# Altium project QUTMS-PDMC-V00.PrjPcb
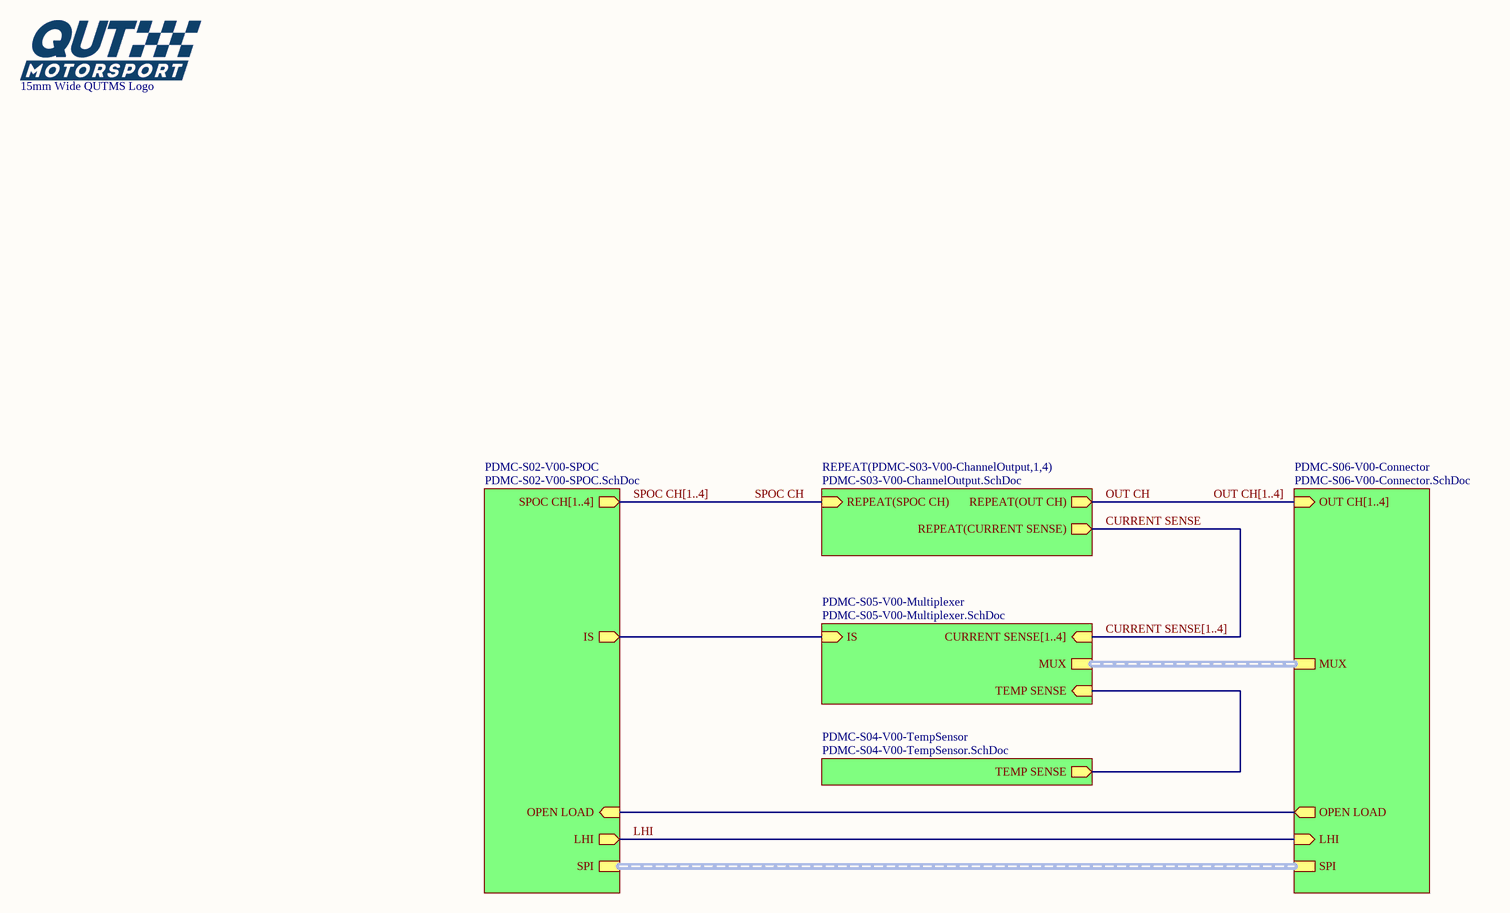
[diagram p0: PDMC-S01-V00-PowerDistributionModuleCard.SchDoc]
6 sheets, 77 parts. Net scope: hierarchical (ports join the sheet entries above them; power ports are global).
Board file: PDMC-P00-V00.PcbDoc
Sheets:
  PDMC-S01-V00-PowerDistributionModuleCard.SchDoc
    PDMC-S02-V00-SPOC = PDMC-S02-V00-SPOC.SchDoc
    PDMC-S06-V00-Connector = PDMC-S06-V00-Connector.SchDoc
    PDMC-S03-V00-ChannelOutput1 = PDMC-S03-V00-ChannelOutput.SchDoc
    PDMC-S03-V00-ChannelOutput2 = PDMC-S03-V00-ChannelOutput.SchDoc
    PDMC-S03-V00-ChannelOutput3 = PDMC-S03-V00-ChannelOutput.SchDoc
    PDMC-S03-V00-ChannelOutput4 = PDMC-S03-V00-ChannelOutput.SchDoc
    PDMC-S05-V00-Multiplexer = PDMC-S05-V00-Multiplexer.SchDoc
    PDMC-S04-V00-TempSensor = PDMC-S04-V00-TempSensor.SchDoc

## Sheet PDMC-S01-V00-PowerDistributionModuleCard.SchDoc: PDMC Master
size A3; DrawnBy: Zoe Goodward; Organization: QUT Motorsport; Address1: O-120, Gardens Point; Address2: 2 George Street; Address3: Brisbane, QLD 4000; Address4: Australia; DocumentNumber: 1; Revision: 01; SheetNumber: 1; SheetTotal: 6; Version: 01; Project: Power Distribution Module Card; PageSetup: Record=PageOptions|CenterHorizontal=True|CenterVertical=True|PrintScale=0.97|XCorrection=1.00|YCorrection=1.00|PrintKind=0|BorderSize=5000000|LeftOffset=0|BottomOffset=0|Orientation=2|PaperLength=1000|PaperWidth=1000|Scale=100|PaperSource=7|PrintQuality=-4|MediaType=1|DitherType=10|PaperKind=A4|PrintScaleMode=1

### Parts
LOGO1  15mm Wide QUTMS Logo  [QUTMS LOGO 15MM]

### Sub-sheets
PDMC-S02-V00-SPOC = PDMC-S02-V00-SPOC.SchDoc: SPOC CH[1..4] (out), IS (out), SPI (harness SPI), LHI (out), OPEN LOAD (in)
PDMC-S04-V00-TempSensor = PDMC-S04-V00-TempSensor.SchDoc: TEMP SENSE (out)
PDMC-S05-V00-Multiplexer = PDMC-S05-V00-Multiplexer.SchDoc: CURRENT SENSE[1..4] (in), IS (in), MUX (harness MUX), TEMP SENSE (in)
PDMC-S06-V00-Connector = PDMC-S06-V00-Connector.SchDoc: OUT CH[1..4] (in), MUX (harness MUX), SPI (harness SPI), LHI (in), OPEN LOAD (out)
REPEAT(PDMC-S03-V00-ChannelOutput,1,4) = PDMC-S03-V00-ChannelOutput.SchDoc: REPEAT(SPOC CH) (in), REPEAT(OUT CH) (out), REPEAT(CURRENT SENSE) (out)

### Nets
CURRENT SENSE: sheet REPEAT(PDMC-S03-V00-ChannelOutput,1,4)/REPEAT(CURRENT SENSE)
LHI: sheet PDMC-S02-V00-SPOC/LHI, sheet PDMC-S06-V00-Connector/LHI
OPEN LOAD: sheet PDMC-S02-V00-SPOC/OPEN LOAD, sheet PDMC-S06-V00-Connector/OPEN LOAD
OUT CH: sheet REPEAT(PDMC-S03-V00-ChannelOutput,1,4)/REPEAT(OUT CH)
SPOC CH: sheet REPEAT(PDMC-S03-V00-ChannelOutput,1,4)/REPEAT(SPOC CH)
SPOC SENSE: sheet PDMC-S02-V00-SPOC/IS, sheet PDMC-S05-V00-Multiplexer/IS
TEMP SENSE: sheet PDMC-S05-V00-Multiplexer/TEMP SENSE, sheet PDMC-S04-V00-TempSensor/TEMP SENSE

### Buses and harness runs
bus CURRENT SENSE[1..4] = sheet PDMC-S05-V00-Multiplexer/CURRENT SENSE[1..4]
bus OUT CH[1..4] = sheet PDMC-S06-V00-Connector/OUT CH[1..4]
bus SPOC CH[1..4] = sheet PDMC-S02-V00-SPOC/SPOC CH[1..4]
harness sheet PDMC-S02-V00-SPOC/SPI = sheet PDMC-S06-V00-Connector/SPI
harness sheet PDMC-S05-V00-Multiplexer/MUX = sheet PDMC-S06-V00-Connector/MUX

### Notes on the sheet
- Revision History:
- Sheet Title:
- Rev
- Date
- Description
- Project:
- Size:
- Drawn By:
- A3
- Number:
- Revision:
- Sheet
- Version:
- of
- QUT Motorsport
- O-120, Gardens Point
- 2 George Street
- Brisbane, QLD 4000
- Australia
- Print Date:
- Print Time:
- File Name:

### Library data of the parts
LOGO1 = QUTMS Logo 15mm

## Sheet PDMC-S02-V00-SPOC.SchDoc: SPOC
size A3; DrawnBy: Zoe Goodward; Organization: QUT Motorsport; Address1: O-120, Gardens Point; Address2: 2 George Street; Address3: Brisbane, QLD 4000; Address4: Australia; DocumentNumber: 2; Revision: 01; SheetNumber: 2; SheetTotal: 6; Version: 01; Project: Power Distribution Module Card; PageSetup: Record=PageOptions|CenterHorizontal=True|CenterVertical=True|PrintScale=0.97|XCorrection=1.00|YCorrection=1.00|PrintKind=0|BorderSize=5000000|LeftOffset=0|BottomOffset=0|Orientation=2|PaperLength=1000|PaperWidth=1000|Scale=100|PaperSource=7|PrintQuality=-4|MediaType=1|DitherType=10|PaperKind=A4|PrintScaleMode=1
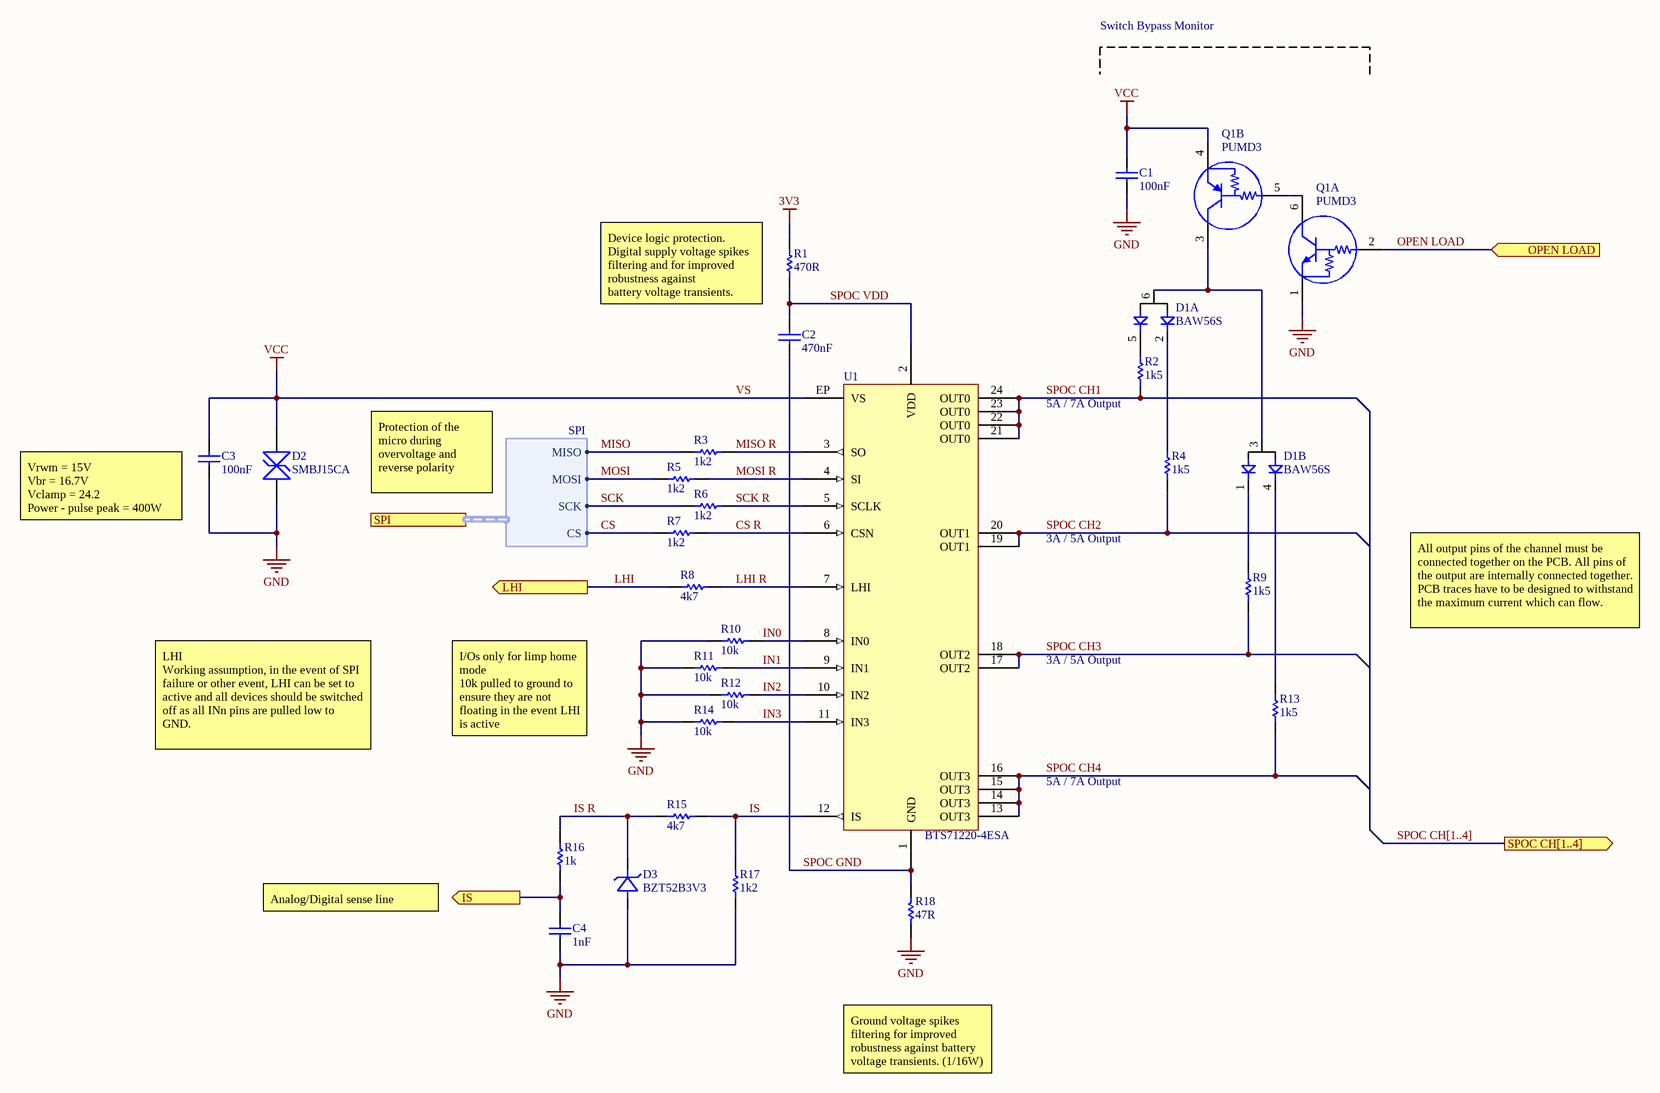
[diagram p1: PDMC-S02-V00-SPOC.SchDoc]

### Parts
C1  100nF  [Cap_Ceramic_0603]
C2  470nF  [Cap_Ceramic_0603]
C3  100nF  [Cap_Ceramic_0603]
C4  1nF  [Cap_Ceramic_0603]
D1  BAW56S  [TSSOP6]  (parts A,B of 2)
D2  SMBJ15CA  [DO-214AA]
D3  BZT52B3V3  [SOD123]
Q1  PUMD3  [TSSOP6]  (parts A,B of 2)
R1  470R  [Res_ThinFilm_1210]
R2  1k5  [Res_ThinFilm_0603]
R3  1k2  [Res_ThinFilm_0603]
R4  1k5  [Res_ThinFilm_0603]
R5  1k2  [Res_ThinFilm_0603]
R6  1k2  [Res_ThinFilm_0603]
R7  1k2  [Res_ThinFilm_0603]
R8  4k7  [Res_ThinFilm_0603]
R9  1k5  [Res_ThinFilm_0603]
R10  10k  [Res_ThinFilm_0603]
R11  10k  [Res_ThinFilm_0603]
R12  10k  [Res_ThinFilm_0603]
R13  1k5  [Res_ThinFilm_0603]
R14  10k  [Res_ThinFilm_0603]
R15  4k7  [Res_ThinFilm_0603]
R16  1k  [Res_ThinFilm_0603]
R17  1k2  [Res_ThinFilm_0603]
R18  47R  [Res_ThinFilm_0603]
U1  BTS71220-4ESA  [PG-TSDO-24-32]

### Ports
IS (out), LHI (out), OPEN LOAD (in), SPI (harness SPI), SPOC CH[1..4] (out)

### Harnesses
SPI: MOSI, MISO, SCK, CS

### Nets
3V3: R1.2
GND: C1.1 C3.1 C4.1 D2.1 D3.A(Anode) Q1.1(E1) R10.1 R11.1 R12.1 R14.1 R17.1 R18.1
VS: C1.2 C3.2 D2.2 Q1.4(E2) U1.EP(VS)  [also labelled VCC]
CS: R7.1 ; port SPI.CS
CS R: R7.2 U1.6(CSN)
IN0: R10.2 U1.8(IN0)
IN1: R11.2 U1.9(IN1)
IN2: R12.2 U1.10(IN2)
IN3: R14.2 U1.11(IN3)
IS: R15.2 R17.2 U1.12(IS)
IS R: D3.K(Cathode) R15.1 R16.2
LHI: R8.1 ; port LHI
LHI R: R8.2 U1.7(LHI)
MISO: R3.1 ; port SPI.MISO
MISO R: R3.2 U1.3(SO)
MOSI: R5.1 ; port SPI.MOSI
MOSI R: R5.2 U1.4(SI)
OPEN LOAD: Q1.2(B1) ; port OPEN LOAD
SCK: R6.1 ; port SPI.SCK
SCK R: R6.2 U1.5(SCLK)
SPOC CH1: R2.1 U1.21(OUT0) U1.22(OUT0) U1.23(OUT0) U1.24(OUT0)
SPOC CH2: R4.1 U1.19(OUT1) U1.20(OUT1)
SPOC CH3: R9.1 U1.17(OUT2) U1.18(OUT2)
SPOC CH4: R13.1 U1.13(OUT3) U1.14(OUT3) U1.15(OUT3) U1.16(OUT3)
SPOC GND: C2.1 R18.2 U1.1(GND)
SPOC SENSE: C4.2 R16.1 ; port IS
SPOC VDD: C2.2 R1.1 U1.2(VDD)
NetD1_1: D1.1 R9.2
NetD1_2: D1.2 R4.2
NetD1_3: D1.3 D1.6 Q1.3(C2)
NetD1_4: D1.4 R13.2
NetD1_5: D1.5 R2.2
NetQ1_5: Q1.5(B2) Q1.6(C1)

### Buses and harness runs
bus SPOC CH[1..4] = port SPOC CH[1..4]

### Notes on the sheet
- Switch Bypass Monitor
- Device logic protection.
  Digital supply voltage spikes filtering and for improved robustness against
  battery voltage transients.
- (near R2) 5A / 7A Output
- (near C3) Vrwm = 15V
  Vbr = 16.7V
  Vclamp = 24.2
  Power - pulse peak = 400W
- Protection of the micro during overvoltage and reverse polarity
- 3A / 5A Output
- All output pins of the channel must be connected together on the PCB. All pins of the output are internally connected together.
  PCB traces have to be designed to withstand the maximum current which can flow.
- I/Os only for limp home mode
  10k pulled to ground to ensure they are not floating in the event LHI is active
- LHI
  Working assumption, in the event of SPI failure or other event, LHI can be set to active and all devices should be switched off as all INn pins are pulled low to GND.
- 5A / 7A Output
- Analog/Digital sense line
- Ground voltage spikes filtering for improved robustness against battery voltage transients. (1/16W)
- Revision History:
- Sheet Title:
- Rev
- Date
- Description
- Project:
- Size:
- Drawn By:
- A3
- Number:
- Revision:
- Sheet
- Version:
- of
- QUT Motorsport
- O-120, Gardens Point
- 2 George Street
- Brisbane, QLD 4000
- Australia
- Print Date:
- Print Time:
- File Name:

### Library data of the parts
C1 C3 = 100nF 50V 5% X7R 0603: Capacitor, Ceramic, SMD, 100nF, 50V, 5%, X7R, 0603
C2 = 470nF 50V 5% X7R 0603: Capacitor, Ceramic, SMD, 470nF, 50V, 5%, X7R, 0603
C4 = 1nF 50V 5% X7R 0603: Capacitor, Ceramic, SMD, 1nF, 25V, 5%, X7R, 0603
D1 = BAW56S: Diode Array 2 Pair Common Anode Standard 90V 250mA (DC) Surface Mount 6-TSSOP, SC-88, SOT-363; ComponentLink1Description: Digikey; ComponentLink1URL: https://www.digikey.com.au/product-detail/en/nexperia-usa-inc/BAW56S-115/1727-4833-1-ND/2531320; ComponentLink2Description: Datasheet; ComponentLink2URL: https://assets.nexperia.com/documents/data-sheet/BAV756S_BAW56_SER.pdf
D2 = SMBJ15CA: Diode, SMD, TVS, 15V, 24.4V, 24.6A Ipp, DO-214AA; ComponentLink1Description: Datasheet; ComponentLink1URL: https://www.littelfuse.com/~/media/electronics/datasheets/tvs_diodes/littelfuse_tvs_diode_smbj_datasheet.pdf.pdf; ComponentLink2Description: Digikey; ComponentLink2URL: https://www.digikey.com.au/product-detail/en/littelfuse-inc/SMBJ15CA/SMBJ15CALFCT-ND/285983
D3 = BZT52B3V3: Diode, SMD, Zener, 3.3V, 2%, 410mW, SOD-123; ComponentLink1Description: Datasheet; ComponentLink1URL: https://www.vishay.com/docs/85760/bzt52.pdf; ComponentLink2Description: Digikey; ComponentLink2URL: https://www.digikey.com/product-detail/en/vishay-semiconductor-diodes-division/BZT52B3V3-E3-08/112-BZT52B3V3-E3-08CT-ND/8564806
Q1 = PUMD3: Pre-Biased Bipolar Transistor (BJT) 1 NPN, 1 PNP - Pre-Biased (Dual) 50V 100mA 300mW Surface Mount 6-TSSOP; ComponentLink1Description: Datasheet; ComponentLink1URL: https://assets.nexperia.com/documents/data-sheet/PEMD3_PIMD3_PUMD3.pdf; ComponentLink2Description: Digikey; ComponentLink2URL: https://www.digikey.com.au/product-detail/en/nexperia-usa-inc/PUMD3-165/1727-1984-1-ND/5221957
R1 = 470R 5% 1210: Resistor, SMD, 470R, 0.25W, 5%, 1210
R2 R4 R9 R13 = 1k5 5% 0603: Resistor, SMD, 1k5, 0.1W, 5%, 0603
R3 R5-R7 R17 = 1k2 5% 0603: Resistor, SMD, 1k2, 0.1W, 5%, 0603
R8 R15 = 4k7 5% 0603: Resistor, SMD, 4k7, 0.1W, 5%, 0603
R10-R12 R14 = 10k 5% 0603: Resistor, SMD, 10k, 0.1W, 5%, 0603
R16 = 1k 5% 0603: Resistor, SMD, 1k, 0.1W, 5%, 0603
R18 = 47R 5% 0603: Resistor, SMD, 47R, 0.1W, 5%, 0603
U1 = BTS71220-4ESA: The BTS71220-4ESA is a SPI Power Controller, providing protection functions and diagnosis. The device is integrated in SMART7 technology.; ComponentLink1Description: Datasheet; ComponentLink1URL: https://www.infineon.com/dgdl/Infineon-BTS71220-4ESA-DS-v01_00-EN.pdf?fileId=5546d462636cc8fb0163feaaf85408d1; ComponentLink2Description: Digikey; ComponentLink2URL: https://www.digikey.com.au/product-detail/en/infineon-technologies/BTS712204ESAXUMA1/BTS712204ESAXUMA1CT-ND/9678741

## Sheet PDMC-S06-V00-Connector.SchDoc: Connectors
size A3; DrawnBy: Zoe Goodward; Organization: QUT Motorsport; Address1: O-120, Gardens Point; Address2: 2 George Street; Address3: Brisbane, QLD 4000; Address4: Australia; DocumentNumber: 6; Revision: 01; SheetNumber: 6; SheetTotal: 6; Version: 01; Project: Power Distribution Module Card; PageSetup: Record=PageOptions|CenterHorizontal=True|CenterVertical=True|PrintScale=0.97|XCorrection=1.00|YCorrection=1.00|PrintKind=0|BorderSize=5000000|LeftOffset=0|BottomOffset=0|Orientation=2|PaperLength=1000|PaperWidth=1000|Scale=100|PaperSource=7|PrintQuality=-4|MediaType=1|DitherType=10|PaperKind=A4|PrintScaleMode=1
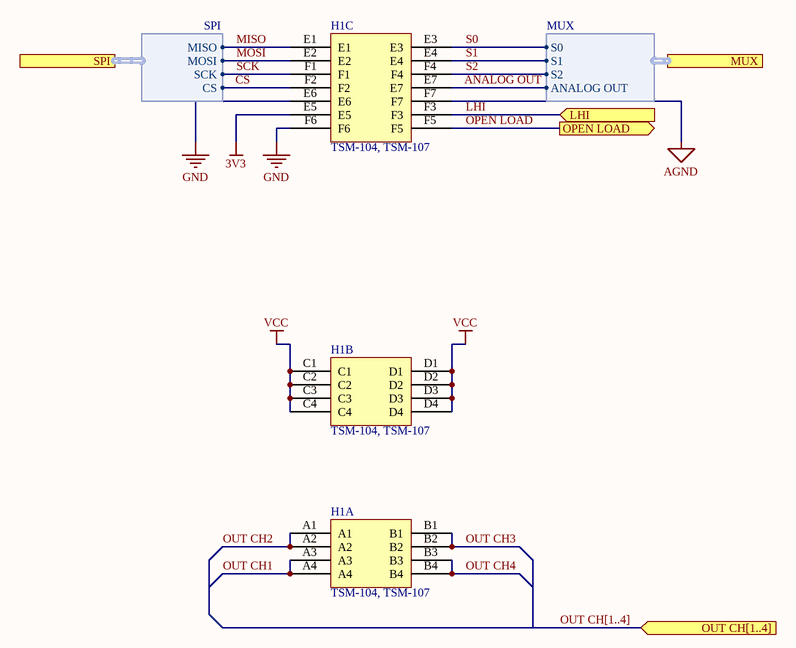
[diagram p2: PDMC-S06-V00-Connector.SchDoc]

### Parts
H1  TSM-104, TSM-107  [TSM-104, TSM-107]  (parts A,B,C of 3)

### Ports
LHI (in), MUX (harness MUX), OPEN LOAD (out), OUT CH[1..4] (in), SPI (harness SPI)

### Harnesses
MUX: ANALOG OUT, S0, S1, S2
SPI: MOSI, MISO, SCK, CS

### Nets
3V3: H1.E5
AGND: H1.F7
GND: H1.E6 H1.F6
VCC: H1.C1 H1.C2 H1.C3 H1.C4 H1.D1 H1.D2 H1.D3 H1.D4  [project net VS]
ANALOG OUT: H1.E7 ; port MUX.ANALOG OUT
CS: H1.F2 ; port SPI.CS
LHI: H1.F3 ; port LHI
MISO: H1.E1 ; port SPI.MISO
MOSI: H1.E2 ; port SPI.MOSI
OPEN LOAD: H1.F5 ; port OPEN LOAD
OUT CH1: H1.A3 H1.A4
OUT CH2: H1.A1 H1.A2
OUT CH3: H1.B1 H1.B2
OUT CH4: H1.B3 H1.B4
S0: H1.E3 ; port MUX.S0
S1: H1.E4 ; port MUX.S1
S2: H1.F4 ; port MUX.S2
SCK: H1.F1 ; port SPI.SCK

### Buses and harness runs
bus OUT CH[1..4] = port OUT CH[1..4]

### Notes on the sheet
- Revision History:
- Sheet Title:
- Rev
- Date
- Description
- Project:
- Size:
- Drawn By:
- A3
- Number:
- Revision:
- Sheet
- Version:
- of
- QUT Motorsport
- O-120, Gardens Point
- 2 George Street
- Brisbane, QLD 4000
- Australia
- Print Date:
- Print Time:
- File Name:

### Library data of the parts
H1 = TSM-104, TSM-107: CONN HEADER SMD R/A 8POS and 14POS 2.54MM; ComponentLink1Description: Digikey; ComponentLink1URL: https://www.digikey.com.au/product-detail/en/samtec-inc/TSM-104-01-L-DH/SAM10277-ND/6679014; ComponentLink2Description: Digikey; ComponentLink2URL: https://www.digikey.com.au/product-detail/en/samtec-inc/TSM-107-01-L-DH/SAM15902-ND/7638593; ComponentLink3Description: Datasheet; ComponentLink3URL: http://suddendocs.samtec.com/catalog_english/tsm.pdf

## Sheet PDMC-S03-V00-ChannelOutput.SchDoc: Channel Output and Current Sensing
size A3; DrawnBy: Zoe Goodward; Organization: QUT Motorsport; Address1: O-120, Gardens Point; Address2: 2 George Street; Address3: Brisbane, QLD 4000; Address4: Australia; DocumentNumber: 3; Revision: 01; SheetNumber: 3; SheetTotal: 6; Version: 01; Project: Power Distribution Module Card; PageSetup: Record=PageOptions|CenterHorizontal=True|CenterVertical=True|PrintScale=0.97|XCorrection=1.00|YCorrection=1.00|PrintKind=0|BorderSize=5000000|LeftOffset=0|BottomOffset=0|Orientation=2|PaperLength=1000|PaperWidth=1000|Scale=100|PaperSource=7|PrintQuality=-4|MediaType=1|DitherType=10|PaperKind=A4|PrintScaleMode=1
Used 4 times, as channels PDMC-S03-V00-ChannelOutput1, PDMC-S03-V00-ChannelOutput2, PDMC-S03-V00-ChannelOutput3, PDMC-S03-V00-ChannelOutput4. Parts and nets are listed once, with the designators drawn on the sheet.
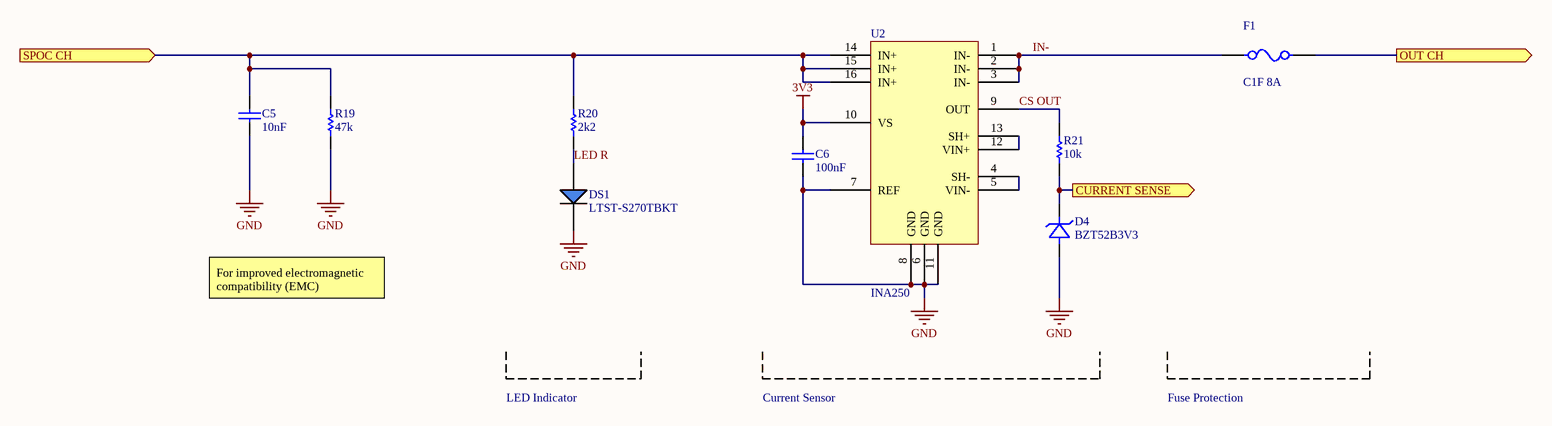
[diagram p3: PDMC-S03-V00-ChannelOutput.SchDoc]

### Parts
C5  10nF  [Cap_Ceramic_0603]
C6  100nF  [Cap_Ceramic_0603]
D4  BZT52B3V3  [SOD123]
DS1  LTST-S270TBKT  [LTST-S270TBKT]
F1  C1F 8A  [FUSE_1206]
R19  47k  [Res_ThinFilm_0603]
R20  2k2  [Res_ThinFilm_0603]
R21  10k  [Res_ThinFilm_0603]
U2  INA250  [TSSOP-16N]

### Ports
CURRENT SENSE (out), OUT CH (out), SPOC CH (in)

### Nets
3V3: C6.2 U2.10(VS)
GND: C5.1 C6.1 D4.A(Anode) DS1.K R19.1 U2.6(GND) U2.7(REF) U2.8(GND) U2.11(GND)
CS OUT: R21.2 U2.9(OUT)
CURRENT SENSE: D4.K(Cathode) R21.1 ; port CURRENT SENSE
IN-: F1.1 U2.1(IN-) U2.2(IN-) U2.3(IN-)
LED R: DS1.A R20.1
OUT CH: F1.2 ; port OUT CH
SPOC CH: C5.2 R19.2 R20.2 U2.14(IN+) U2.15(IN+) U2.16(IN+) ; port SPOC CH
NetU2_4: U2.4(SH-) U2.5(VIN-)
NetU2_12: U2.12(VIN+) U2.13(SH+)

### Channels
PDMC-S03-V00-ChannelOutput1: designators end in A; ports CURRENT SENSE=CURRENT SENSE1 OUT CH=OUT CH1 SPOC CH=SPOC CH1
PDMC-S03-V00-ChannelOutput2: designators end in B; ports CURRENT SENSE=CURRENT SENSE2 OUT CH=OUT CH2 SPOC CH=SPOC CH2
PDMC-S03-V00-ChannelOutput3: designators end in C; ports CURRENT SENSE=CURRENT SENSE3 OUT CH=OUT CH3 SPOC CH=SPOC CH3
PDMC-S03-V00-ChannelOutput4: designators end in D; ports CURRENT SENSE=CURRENT SENSE4 OUT CH=OUT CH4 SPOC CH=SPOC CH4

### Notes on the sheet
- For improved electromagnetic compatibility (EMC)
- LED Indicator
- Current Sensor
- Fuse Protection
- Revision History:
- Sheet Title:
- Rev
- Date
- Description
- Project:
- Size:
- Drawn By:
- A3
- Number:
- Revision:
- Sheet
- Version:
- of
- QUT Motorsport
- O-120, Gardens Point
- 2 George Street
- Brisbane, QLD 4000
- Australia
- Print Date:
- Print Time:
- File Name:

### Library data of the parts
C5 = 10nF 25V 5% X7R 0603: Capacitor, Ceramic, SMD, 10nF, 25V, 5%, X7R, 0603
C6 = 100nF 50V 5% X7R 0603: as C1 on sheet PDMC-S02-V00-SPOC
D4 = BZT52B3V3: as D3 on sheet PDMC-S02-V00-SPOC; ComponentLink1Description: Datasheet; ComponentLink1URL: https://www.vishay.com/docs/85760/bzt52.pdf; ComponentLink2Description: Digikey; ComponentLink2URL: https://www.digikey.com/product-detail/en/vishay-semiconductor-diodes-division/BZT52B3V3-E3-08/112-BZT52B3V3-E3-08CT-ND/8564806
DS1 = LTST-S270TBKT: Blue 465~475nm 0603 Light Emitting Diodes (LED) RoHS
F1 = C1F 8: 8A 125V AC 63V DC Fuse Board Mount (Cartridge Style Excluded) Surface Mount 1206 (3216 Metric); ComponentLink1Description: Datasheet; ComponentLink1URL: https://belfuse.com/resources/datasheets/circuitprotection/ds-cp-c1f-series.pdf; ComponentLink2Description: Digikey; ComponentLink2URL: https://www.digikey.com.au/product-detail/en/bel-fuse-inc/C1F-8/507-1889-1-ND/4968171
R19 = 47k 5% 0603: Resistor, SMD, 47k, 0.1W, 5%, 0603
R20 = 2k2 5% 0603: Resistor, SMD, 2k2, 0.1W, 5%, 0603
R21 = 10k 5% 0603: Resistor, SMD, 10k, 0.1W, 5%, 0603
U2 = INA250: INA250 36-V, Low- or High-Side, Bidirectional, Zero-Drift Current-Shunt Monitor with Precision Integrated Shunt Resistor; ComponentLink1Description: Datasheet; ComponentLink1URL: https://www.ti.com/lit/ds/symlink/ina250.pdf?HQS=TI-null-null-digikeymode-df-pf-null-wwe&ts=1595428770724; ComponentLink2Description: Digikey - A4; ComponentLink2URL: https://www.digikey.com.au/product-detail/en/texas-instruments/INA250A4PWR/296-43804-1-ND/5870052

## Sheet PDMC-S05-V00-Multiplexer.SchDoc: Sense Multiplexing
size A3; DrawnBy: Zoe Goodward; Organization: QUT Motorsport; Address1: O-120, Gardens Point; Address2: 2 George Street; Address3: Brisbane, QLD 4000; Address4: Australia; DocumentNumber: 5; Revision: 01; SheetNumber: 5; SheetTotal: 6; Version: 01; Project: Power Distribution Module Card; PageSetup: Record=PageOptions|CenterHorizontal=True|CenterVertical=True|PrintScale=0.97|XCorrection=1.00|YCorrection=1.00|PrintKind=0|BorderSize=5000000|LeftOffset=0|BottomOffset=0|Orientation=2|PaperLength=1000|PaperWidth=1000|Scale=100|PaperSource=7|PrintQuality=-4|MediaType=1|DitherType=10|PaperKind=A4|PrintScaleMode=1
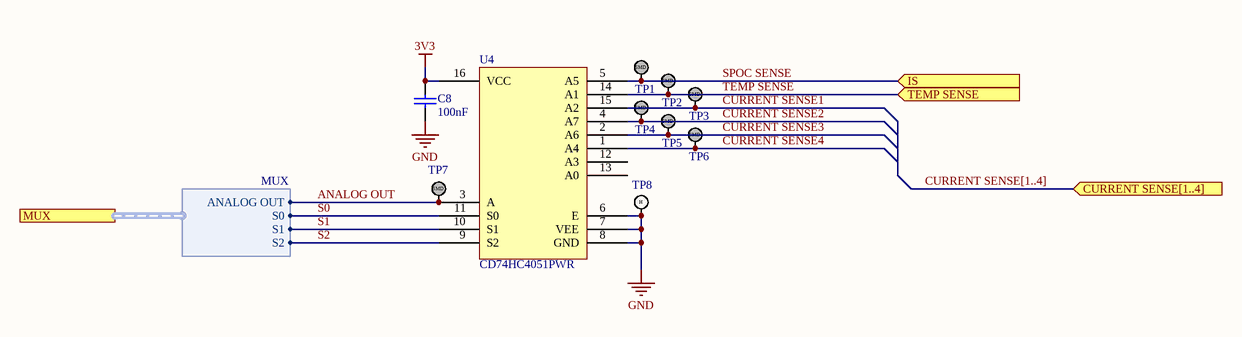
[diagram p4: PDMC-S05-V00-Multiplexer.SchDoc]

### Parts
C8  100nF  [Cap_Ceramic_0603]
TP1  TestPoint_SMD  [TestPointSMD]  (value not drawn)
TP2  TestPoint_SMD  [TestPointSMD]  (value not drawn)
TP3  TestPoint_SMD  [TestPointSMD]  (value not drawn)
TP4  TestPoint_SMD  [TestPointSMD]  (value not drawn)
TP5  TestPoint_SMD  [TestPointSMD]  (value not drawn)
TP6  TestPoint_SMD  [TestPointSMD]  (value not drawn)
TP7  TestPoint_SMD  [TestPointSMD]  (value not drawn)
TP8  TestPoint_Hoop_White  [TestPointHoop_WHITE]  (value not drawn)
U4  CD74HC4051PWR  [TSSOP-16N]

### Ports
CURRENT SENSE[1..4] (in), IS (in), MUX (harness MUX), TEMP SENSE (in)

### Harnesses
MUX: ANALOG OUT, S0, S1, S2

### Nets
3V3: C8.2 U4.16(VCC)
GND: C8.1 TP8.1 U4.6(E) U4.7(VEE) U4.8(GND)
ANALOG OUT: TP7.1 U4.3(A) ; port MUX.ANALOG OUT
CURRENT SENSE1: TP3.1 U4.15(A2)
CURRENT SENSE2: TP4.1 U4.4(A7)
CURRENT SENSE3: TP5.1 U4.2(A6)
CURRENT SENSE4: TP6.1 U4.1(A4)
S0: U4.11(S0) ; port MUX.S0
S1: U4.10(S1) ; port MUX.S1
S2: U4.9(S2) ; port MUX.S2
SPOC SENSE: TP1.1 U4.5(A5) ; port IS
TEMP SENSE: TP2.1 U4.14(A1) ; port TEMP SENSE

Not connected (* = marked no-connect by the designer): U4 12(A3) 13(A0)

### Buses and harness runs
bus CURRENT SENSE[1..4] = port CURRENT SENSE[1..4]

### Notes on the sheet
- Revision History:
- Sheet Title:
- Rev
- Date
- Description
- Project:
- Size:
- Drawn By:
- A3
- Number:
- Revision:
- Sheet
- Version:
- of
- QUT Motorsport
- O-120, Gardens Point
- 2 George Street
- Brisbane, QLD 4000
- Australia
- Print Date:
- Print Time:
- File Name:
- (in symbol TestPoint_Hoop_White) H
- (in symbol TestPoint_SMD) SMD

### Library data of the parts
C8 = 100nF 50V 5% X7R 0603: as C1 on sheet PDMC-S02-V00-SPOC
U4 = CD74HC4051PWR: IC MUX/DEMUX 8X1 16TSSOP; ComponentLink1Description: Datasheet; ComponentLink1URL: https://www.ti.com/lit/ds/symlink/cd74hc4051.pdf?HQS=TI-null-null-digikeymode-df-pf-null-wwe&ts=1595658940184; ComponentLink2Description: Digikey; ComponentLink2URL: https://www.digikey.com/product-detail/en/texas-instruments/CD74HC4051PWR/296-13031-1-ND/480146

## Sheet PDMC-S04-V00-TempSensor.SchDoc: Temperature Sensor
size A3; DrawnBy: Zoe Goodward; Organization: QUT Motorsport; Address1: O-120, Gardens Point; Address2: 2 George Street; Address3: Brisbane, QLD 4000; Address4: Australia; DocumentNumber: 4; Revision: 01; SheetNumber: 4; SheetTotal: 6; Version: 01; Project: Power Distribution Module Card; PageSetup: Record=PageOptions|CenterHorizontal=True|CenterVertical=True|PrintScale=0.97|XCorrection=1.00|YCorrection=1.00|PrintKind=0|BorderSize=5000000|LeftOffset=0|BottomOffset=0|Orientation=2|PaperLength=1000|PaperWidth=1000|Scale=100|PaperSource=7|PrintQuality=-4|MediaType=1|DitherType=10|PaperKind=A4|PrintScaleMode=1
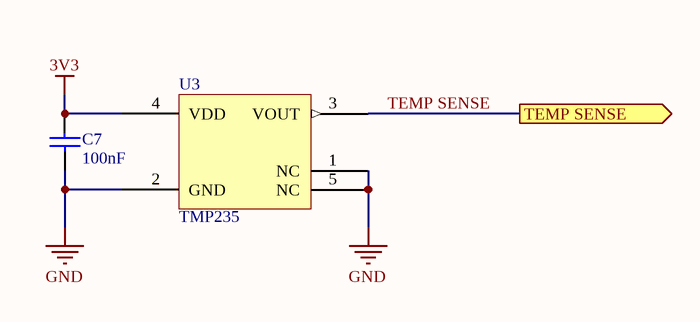
[diagram p5: PDMC-S04-V00-TempSensor.SchDoc]

### Parts
C7  100nF  [Cap_Ceramic_0603]
U3  TMP235  [SC70]

### Ports
TEMP SENSE (out)

### Nets
3V3: C7.2 U3.4(VDD)
GND: C7.1 U3.1(NC) U3.2(GND) U3.5(NC)
TEMP SENSE: U3.3(VOUT) ; port TEMP SENSE

### Notes on the sheet
- Revision History:
- Sheet Title:
- Rev
- Date
- Description
- Project:
- Size:
- Drawn By:
- A3
- Number:
- Revision:
- Sheet
- Version:
- of
- QUT Motorsport
- O-120, Gardens Point
- 2 George Street
- Brisbane, QLD 4000
- Australia
- Print Date:
- Print Time:
- File Name:

### Library data of the parts
C7 = 100nF 50V 5% X7R 0603: as C1 on sheet PDMC-S02-V00-SPOC
U3 = TMP235: TMP235, Low-Power, High-Accuracy Analog Output Temperature Sensor; ComponentLink1Description: Datasheet; ComponentLink1URL: https://www.ti.com/lit/ds/symlink/tmp235.pdf?HQS=TI-null-null-digikeymode-df-pf-null-wwe&ts=1595645947985; ComponentLink2Description: Digikey; ComponentLink2URL: https://www.digikey.com.au/product-detail/en/texas-instruments/TMP235A4DCKR/296-50016-1-ND/9462854

## Nets that join several sheets
3V3: PDMC-S02-V00-SPOC (R1.2), PDMC-S06-V00-Connector (H1.E5), PDMC-S03-V00-ChannelOutput1 (C6A.2 U2A.10), PDMC-S03-V00-ChannelOutput2 (C6B.2 U2B.10), PDMC-S03-V00-ChannelOutput3 (C6C.2 U2C.10), PDMC-S03-V00-ChannelOutput4 (C6D.2 U2D.10), PDMC-S05-V00-Multiplexer (C8.2 U4.16), PDMC-S04-V00-TempSensor (C7.2 U3.4)
GND: PDMC-S02-V00-SPOC (12 pins), PDMC-S06-V00-Connector (H1.E6 H1.F6), PDMC-S03-V00-ChannelOutput1 (9 pins), PDMC-S03-V00-ChannelOutput2 (9 pins), PDMC-S03-V00-ChannelOutput3 (9 pins), PDMC-S03-V00-ChannelOutput4 (9 pins), PDMC-S05-V00-Multiplexer (5 pins), PDMC-S04-V00-TempSensor (C7.1 U3.1 U3.2 U3.5)
VS: PDMC-S02-V00-SPOC (5 pins), PDMC-S06-V00-Connector (8 pins)
ANALOG OUT: PDMC-S06-V00-Connector (H1.E7), PDMC-S05-V00-Multiplexer (TP7.1 U4.3)
CS: PDMC-S02-V00-SPOC (R7.1), PDMC-S06-V00-Connector (H1.F2)
CURRENT SENSE1: PDMC-S03-V00-ChannelOutput1 (D4A.K R21A.1), PDMC-S05-V00-Multiplexer (TP3.1 U4.15)
CURRENT SENSE2: PDMC-S03-V00-ChannelOutput2 (D4B.K R21B.1), PDMC-S05-V00-Multiplexer (TP4.1 U4.4)
CURRENT SENSE3: PDMC-S03-V00-ChannelOutput3 (D4C.K R21C.1), PDMC-S05-V00-Multiplexer (TP5.1 U4.2)
CURRENT SENSE4: PDMC-S03-V00-ChannelOutput4 (D4D.K R21D.1), PDMC-S05-V00-Multiplexer (TP6.1 U4.1)
LHI: PDMC-S02-V00-SPOC (R8.1), PDMC-S06-V00-Connector (H1.F3)
MISO: PDMC-S02-V00-SPOC (R3.1), PDMC-S06-V00-Connector (H1.E1)
MOSI: PDMC-S02-V00-SPOC (R5.1), PDMC-S06-V00-Connector (H1.E2)
OPEN LOAD: PDMC-S02-V00-SPOC (Q1.2), PDMC-S06-V00-Connector (H1.F5)
OUT CH1: PDMC-S06-V00-Connector (H1.A3 H1.A4), PDMC-S03-V00-ChannelOutput1 (F1A.2)
OUT CH2: PDMC-S06-V00-Connector (H1.A1 H1.A2), PDMC-S03-V00-ChannelOutput2 (F1B.2)
OUT CH3: PDMC-S06-V00-Connector (H1.B1 H1.B2), PDMC-S03-V00-ChannelOutput3 (F1C.2)
OUT CH4: PDMC-S06-V00-Connector (H1.B3 H1.B4), PDMC-S03-V00-ChannelOutput4 (F1D.2)
S0: PDMC-S06-V00-Connector (H1.E3), PDMC-S05-V00-Multiplexer (U4.11)
S1: PDMC-S06-V00-Connector (H1.E4), PDMC-S05-V00-Multiplexer (U4.10)
S2: PDMC-S06-V00-Connector (H1.F4), PDMC-S05-V00-Multiplexer (U4.9)
SCK: PDMC-S02-V00-SPOC (R6.1), PDMC-S06-V00-Connector (H1.F1)
SPOC CH1: PDMC-S02-V00-SPOC (5 pins), PDMC-S03-V00-ChannelOutput1 (6 pins)
SPOC CH2: PDMC-S02-V00-SPOC (R4.1 U1.19 U1.20), PDMC-S03-V00-ChannelOutput2 (6 pins)
SPOC CH3: PDMC-S02-V00-SPOC (R9.1 U1.17 U1.18), PDMC-S03-V00-ChannelOutput3 (6 pins)
SPOC CH4: PDMC-S02-V00-SPOC (5 pins), PDMC-S03-V00-ChannelOutput4 (6 pins)
SPOC SENSE: PDMC-S02-V00-SPOC (C4.2 R16.1), PDMC-S05-V00-Multiplexer (TP1.1 U4.5)
TEMP SENSE: PDMC-S05-V00-Multiplexer (TP2.1 U4.14), PDMC-S04-V00-TempSensor (U3.3)